# Altium schematic sheet lv_io_retro.SchDoc
size A4; Organization: Badgerloop; Address1: 133 Engineering Research; Address2: Building; Address3: Madison, WI 53715
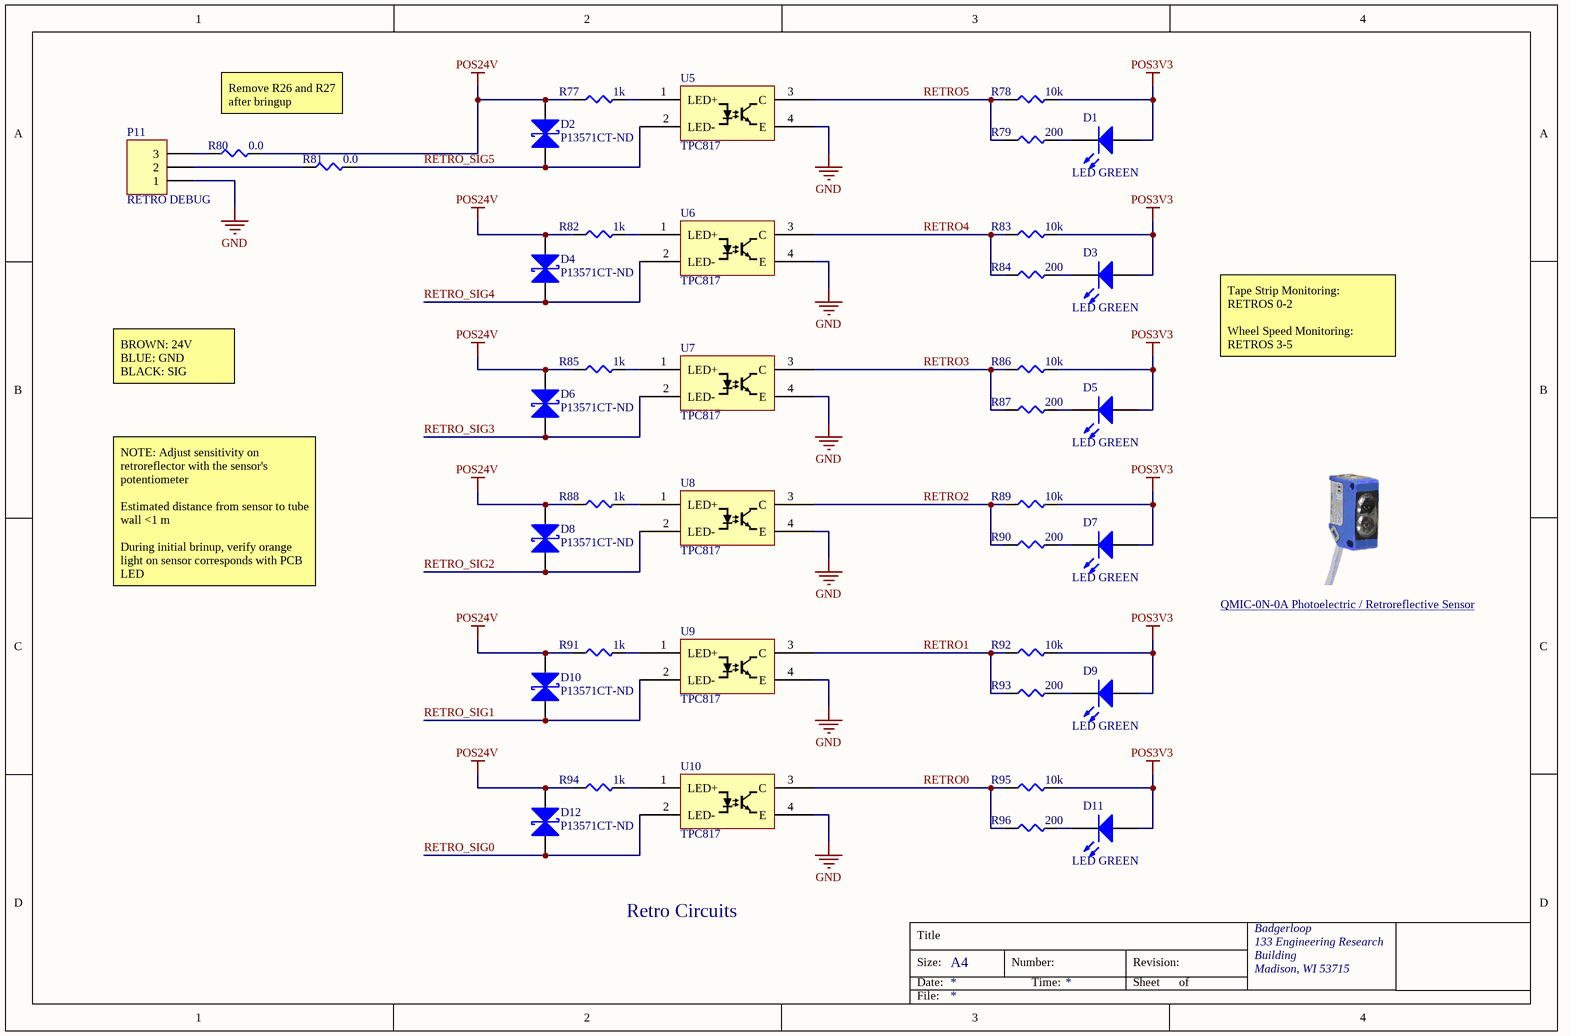
[diagram p0: lv_io_retro.SchDoc]

## Parts
D1  LED GREEN  [LED 0603 GREEN]
D2  Digikey P/N: P13571CT-ND  [SMD-0402-RES]  (hidden comment: ESD Diode)
D3  LED GREEN  [LED 0603 GREEN]
D4  Digikey P/N: P13571CT-ND  [SMD-0402-RES]  (hidden comment: ESD Diode)
D5  LED GREEN  [LED 0603 GREEN]
D6  Digikey P/N: P13571CT-ND  [SMD-0402-RES]  (hidden comment: ESD Diode)
D7  LED GREEN  [LED 0603 GREEN]
D8  Digikey P/N: P13571CT-ND  [SMD-0402-RES]  (hidden comment: ESD Diode)
D9  LED GREEN  [LED 0603 GREEN]
D10  Digikey P/N: P13571CT-ND  [SMD-0402-RES]  (hidden comment: ESD Diode)
D11  LED GREEN  [LED 0603 GREEN]
D12  Digikey P/N: P13571CT-ND  [SMD-0402-RES]  (hidden comment: ESD Diode)
P11  RETRO DEBUG  [Pin Header 1x3 TH Pitch 2.54mm]
R77  1k  [SMD-0603-RES]
R78  10k  [SMD-0603-RES]
R79  200  [SMD-0603-RES]
R80  0.0  [SMD-0402-RES]
R81  0.0  [SMD-0402-RES]
R82  1k  [SMD-0603-RES]
R83  10k  [SMD-0603-RES]
R84  200  [SMD-0603-RES]
R85  1k  [SMD-0603-RES]
R86  10k  [SMD-0603-RES]
R87  200  [SMD-0603-RES]
R88  1k  [SMD-0603-RES]
R89  10k  [SMD-0603-RES]
R90  200  [SMD-0603-RES]
R91  1k  [SMD-0603-RES]
R92  10k  [SMD-0603-RES]
R93  200  [SMD-0603-RES]
R94  1k  [SMD-0603-RES]
R95  10k  [SMD-0603-RES]
R96  200  [SMD-0603-RES]
U5  TPC817  [SOT200P1005X328-5N]
U6  TPC817  [SOT200P1005X328-5N]
U7  TPC817  [SOT200P1005X328-5N]
U8  TPC817  [SOT200P1005X328-5N]
U9  TPC817  [SOT200P1005X328-5N]
U10  TPC817  [SOT200P1005X328-5N]

## Nets
GND: P11.1 U5.4(E) U6.4(E) U7.4(E) U8.4(E) U9.4(E) U10.4(E)
POS3V3: D1.1(A) D3.1(A) D5.1(A) D7.1(A) D9.1(A) D11.1(A) R78.2 R83.2 R86.2 R89.2 R92.2 R95.2
POS24V: D2.2(K) D4.2(K) D6.2(K) D8.2(K) D10.2(K) D12.2(K) R77.1 R80.2 R82.1 R85.1 R88.1 R91.1 R94.1
RETRO0: R95.1 R96.1 U10.3(C)
RETRO1: R92.1 R93.1 U9.3(C)
RETRO2: R89.1 R90.1 U8.3(C)
RETRO3: R86.1 R87.1 U7.3(C)
RETRO4: R83.1 R84.1 U6.3(C)
RETRO5: R78.1 R79.1 U5.3(C)
RETRO_SIG0: D12.1(A) U10.2(LED-)
RETRO_SIG1: D10.1(A) U9.2(LED-)
RETRO_SIG2: D8.1(A) U8.2(LED-)
RETRO_SIG3: D6.1(A) U7.2(LED-)
RETRO_SIG4: D4.1(A) U6.2(LED-)
RETRO_SIG5: D2.1(A) R81.2 U5.2(LED-)
NetD1_2: D1.2(K) R79.2
NetD3_2: D3.2(K) R84.2
NetD5_2: D5.2(K) R87.2
NetD7_2: D7.2(K) R90.2
NetD9_2: D9.2(K) R93.2
NetD11_2: D11.2(K) R96.2
NetP11_2: P11.2 R81.1
NetP11_3: P11.3 R80.1
NetR77_2: R77.2 U5.1(LED+)
NetR82_2: R82.2 U6.1(LED+)
NetR85_2: R85.2 U7.1(LED+)
NetR88_2: R88.2 U8.1(LED+)
NetR91_2: R91.2 U9.1(LED+)
NetR94_2: R94.2 U10.1(LED+)

## Notes on the sheet
- Remove R26 and R27 after bringup
- BROWN: 24V
  BLUE: GND
  BLACK: SIG
- Tape Strip Monitoring:
  RETROS 0-2
  Wheel Speed Monitoring:
  RETROS 3-5
- NOTE: Adjust sensitivity on retroreflector with the sensor's potentiometer
  Estimated distance from sensor to tube wall <1 m
  During initial brinup, verify orange light on sensor corresponds with PCB LED
- QMIC-0N-0A Photoelectric / Retroreflective Sensor <https://www.automationdirect.com/adc/shopping/catalog/sensors_-z-_encoders/photoelectric_sensors/dc_rectangular/retroreflective_(qm-z-cx-z-fe_series)/qmic-0n-0a>
- Retro Circuits
- Title
- Size:
- Date:
- A4
- Number:
- Time:
- Revision:
- Sheet
- of
- File:

## Library data of the parts
D1 D3 D5 D7 D9 D11 = LED GREEN 0603: Manufacturer: Lite-On Inc.; Manufacturer P/N: LTST-C190KGKT; Digikey P/N: 160-1435-1-ND; Package / Case: 0603; Color: GREEN
D2 D4 D6 D8 D10 D12 = ESD Diode: ESD Supressor; Manufacturer P/N: Panasonic; Manufacturer: EZAEG; Digikey Link: https://www.digikey.com/product-detail/en/panasonic-electronic-components/EZA-EG2A50AX/P13571CT-ND/1137239
P11 = Header 3: Header, 3-Pin; LatestRevisionDate: 17-Jul-2002; LatestRevisionNote: Re-released for DXP Platform.; Publisher: Altium Limited
R77 R82 R85 R88 R91 R94 = ERJ-P03F1001V: RES SMD 1K OHM 1% 1/5W 0603; Manufacturer: Panasonic Electronic Components; Factory Stock: 0; Unit Price (USD): 0.05227; @ qty: 1500; Minimum Quantity: 1; Power (Watts): 0.2W, 1/5W; Temperature Coefficient: ±200ppm/°C; Value: 1k; Part Number: ERJ-P03F1001V; Datasheets: https://industrial.panasonic.com/cdbs/www-data/pdf/RDA0000/AOA0000C243.pdf; Image: //media.digikey.com/Photos/Panasonic%20Photos/MFG_ERJ-P6W%20Series.jpg; Digi-Key Part Number: P16018CT-ND; Quantity Available: 3331; Packaging: Cut Tape (CT); Series: ERJ; Part Status: Active; Tolerance: ±1%; Composition: Thick Film; Features: Automotive AEC-Q200, Pulse Withstanding; Operating Temperature: -55°C ~ 155°C; Package / Case: 0603 (1608 Metric); Supplier Device Package: 0603; Size / Dimension: 0.063" L x 0.031" W (1.60mm x 0.80mm); Height - Seated (Max): 0.022" (0.55mm); Number of Terminations: 2; Failure Rate: -
R78 R83 R86 R89 R92 R95 = ERJ-P03J103V: RES SMD 10K OHM 5% 1/5W 0603; Manufacturer: Panasonic Electronic Components; Factory Stock: 0; Unit Price (USD): 0.03584; @ qty: 1500; Minimum Quantity: 1; Power (Watts): 0.2W, 1/5W; Temperature Coefficient: ±200ppm/°C; Value: 10k; Part Number: ERJ-P03J103V; Datasheets: https://industrial.panasonic.com/cdbs/www-data/pdf/RDA0000/AOA0000C243.pdf; Image: //media.digikey.com/Photos/Panasonic%20Photos/MFG_ERJ-P6W%20Series.jpg; Digi-Key Part Number: P16032CT-ND; Quantity Available: 857; Packaging: Cut Tape (CT); Series: ERJ; Part Status: Active; Tolerance: ±5%; Composition: Thick Film; Features: Automotive AEC-Q200, Pulse Withstanding; Operating Temperature: -55°C ~ 155°C; Package / Case: 0603 (1608 Metric); Supplier Device Package: 0603; Size / Dimension: 0.063" L x 0.031" W (1.60mm x 0.80mm); Height - Seated (Max): 0.022" (0.55mm); Number of Terminations: 2; Failure Rate: -
R79 R84 R87 R90 R93 R96 = ERJ-P03J201V: RES SMD 200 OHM 5% 1/5W 0603; Manufacturer: Panasonic Electronic Components; Factory Stock: 0; Unit Price (USD): 0.03584; @ qty: 1500; Minimum Quantity: 1; Power (Watts): 0.2W, 1/5W; Temperature Coefficient: ±200ppm/°C; Value: 200; Part Number: ERJ-P03J201V; Datasheets: https://industrial.panasonic.com/cdbs/www-data/pdf/RDA0000/AOA0000C243.pdf; Image: //media.digikey.com/Photos/Panasonic%20Photos/MFG_ERJ-P6W%20Series.jpg; Digi-Key Part Number: P16033CT-ND; Quantity Available: 6803; Packaging: Cut Tape (CT); Series: ERJ; Part Status: Active; Tolerance: ±5%; Composition: Thick Film; Features: Automotive AEC-Q200, Pulse Withstanding; Operating Temperature: -55°C ~ 155°C; Package / Case: 0603 (1608 Metric); Supplier Device Package: 0603; Size / Dimension: 0.063" L x 0.031" W (1.60mm x 0.80mm); Height - Seated (Max): 0.022" (0.55mm); Number of Terminations: 2; Failure Rate: -
R80 R81 = ERJ-2GE0R00X: RES SMD 0.0OHM JUMPER 1/10W 0402; Manufacturer: Panasonic Electronic Components; Factory Stock: 0; Unit Price (USD): 0.00384; @ qty: 1500; Minimum Quantity: 1; Power (Watts): 0.1W, 1/10W; Part Number: ERJ-2GE0R00X; Datasheets: http://industrial.panasonic.com/www-cgi/jvcr13pz.cgi?E+PZ+3+AOA0001+ERJ2GE0R00X+7+WW; Image: //media.digikey.com/Photos/Panasonic%20Photos/ERJ-PA2-Series.jpg; Digi-Key Part Number: P0.0JCT-ND; Quantity Available: 3152483; Packaging: Cut Tape (CT); Series: ERJ; Part Status: Active; Value: 0.0; Tolerance: Jumper; Composition: Thick Film; Features: Automotive AEC-Q200; Temperature Coefficient: -; Operating Temperature: -55°C ~ 155°C; Package / Case: 0402 (1005 Metric); Supplier Device Package: 0402; Size / Dimension: 0.039" L x 0.020" W (1.00mm x 0.50mm); Height - Seated (Max): 0.016" (0.40mm); Number of Terminations: 2; Failure Rate: -
U5-U10 = TPC817: OPTOISO 5KV TRANS 4SOP; Manufacturer: Taiwan Semi; Manufacturer P/N: TPC817S1B RAG; Digikey Link: https://www.digikey.com/product-detail/en/taiwan-semiconductor-corporation/TPC817S1B-RAG/TPC817S1BRAGCT-ND/7359679; Digikey P/N: TPC817S1BRAGCT-ND